# Altium schematic sheet AP62500_4V.SchDoc
size A4; SheetNumber: 5; SheetTotal: 27
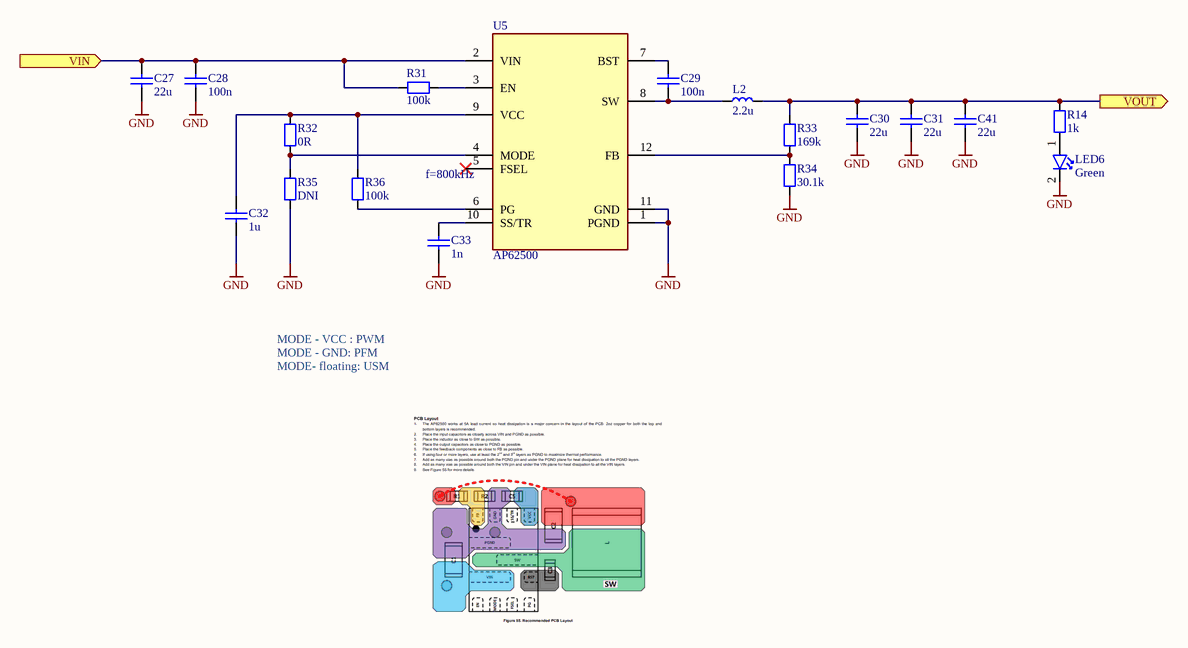
[diagram p0: AP62500_4V.SchDoc]

## Parts
C27  22u  [C_1206_3216Metric_IPC_N]
C28  100n  [C_0603_1608Metric_IPC_N]
C29  100n  [C_0402_1005Metric_IPC_N]
C30  22u  [C_1206_3216Metric_IPC_N]
C31  22u  [C_1206_3216Metric_IPC_N]
C32  1u  [C_0603_1608Metric_IPC_N]
C33  1n  [C_0402_1005Metric_IPC_N]
C41  22u  [C_1206_3216Metric_IPC_N]
L2  2.2u  [AVX_LMLP07A7]
LED6  Green  [LED_0603_1806Metric_IPC_N]
R14  1k  [R_0402_1005Metric_IPC_N]
R31  100k  [R_0402_1005Metric_IPC_N]
R32  0R  [R_0402_1005Metric_IPC_N]
R33  169k  [R_0402_1005Metric_IPC_N]
R34  30.1k  [R_0402_1005Metric_IPC_N]
R35  DNI  [R_0402_1005Metric_IPC_N]
R36  100k  [R_0402_1005Metric_IPC_N]
U5  AP62500  [V-QFN2030-12-Type-A_3.05x2.05mm_P0.5mm]

## Ports
VIN (in, see Power_Supply[3B], AP62500_6V[1B], TPS61377_16V[1B]), VOUT (out, see Power_Supply[3B])

## Nets
GND: C27.1 C28.1 C30.1 C31.1 C32.1 C33.1 C41.1 LED6.2 R34.1 R35.1 U5.1(PGND) U5.11(GND)
VIN: C27.2 C28.2 R31.1 U5.2(VIN) ; port VIN
VOUT: C30.2 C31.2 C41.2 L2.2 R14.1 R33.2 ; port VOUT
NetC29_1: C29.1 L2.1 U5.8(SW)
NetC29_2: C29.2 U5.7(BST)
NetC32_2: C32.2 R32.2 R36.2 U5.9(VCC)
NetC33_2: C33.2 U5.10(SS/TR)
NetLED6_1: LED6.1 R14.2
NetR31_2: R31.2 U5.3(EN)
NetR32_1: R32.1 R35.2 U5.4(MODE)
NetR33_1: R33.1 R34.2 U5.12(FB)
NetR36_1: R36.1 U5.6(PG)

Not connected (* = marked no-connect by the designer): U5 5(FSEL)*

## Notes on the sheet
- (near U5) f=800kHz
- MODE - VCC : PWM
  MODE - GND: PFM
  MODE- floating: USM

## Library data of the parts
C27 C30 C31 C41 = C000005: Generic MLCC with 1206 Footprint; Specific Component: False; ID: C000005; Capacitance: 22u; Tolerance: *; Temp Coefficient: *; Voltage Rated: *; min Temperature: *; max Temperature: *; Case: 1206
C28 C32 = C000003: Generic MLCC with 0603 Footprint; Specific Component: False; ID: C000003; Tolerance: *; Temp Coefficient: *; Voltage Rated: *; min Temperature: *; max Temperature: *; Case: 0603
  C28: Capacitance: 100n
  C32: Capacitance: 1u; Supplier 1: Mouser; Supplier Part Number 1: 81-GRM185R61E105KA2D
C29 C33 = C000002: Generic MLCC with 0402 Footprint; Specific Component: False; ID: C000002; Tolerance: *; Temp Coefficient: *; Voltage Rated: *; min Temperature: *; max Temperature: *; Case: 0402
  C29: Capacitance: 100n; Supplier 1: Digikey; Supplier Part Number 1: 1292-1176-1-ND
  C33: Capacitance: 1n; Supplier 1: Mouser; Supplier Part Number 1: 81-GRM1555C2A102GE1D
L2 = L000012: Power Inductor, 2.2u, 8A, -, 20m, 20%, LMLP07A7; Manufacturer: Kyocera/AVX; Manufacturer Part Number: LMLP07A7M2R2DTAS; Current - Saturation: 12A; min Temperature: -55; max Temperature: +155; ID: L000012; Type: Power Inductor; Inductance: 2.2u; Tolerance: 20%; Current Rating: 8A; DC resistance: 20m; Q @ Freq: -; Case: LMLP07A7; ComponentLink1Description: Datasheet; ComponentLink1URL: https://datasheets.kyocera-avx.com/LMLPD.pdf; Supplier 1: Digikey; Supplier Part Number 1: 478-LMLP07A7M2R2DTASCT-ND; Supplier 2: Mouser; Supplier Part Number 2: 581-LMLP07A7M2R2DTAS
LED6 = LED000007: MLCC, Low Current, Green, 2.2V, 20mA, 0603; Manufacturer: Broadcom / Avago; Manufacturer Part Number: HSMG-C190; Specific Component: True; ID: LED000007; Type: Low Current; Colour: Green; Forward Voltage: 2.2V; Current: 20mA; Case: 0603; ComponentLink1Description: Datasheet; ComponentLink1URL: https://www.mouser.de/datasheet/3/57/1/AV02_0551EN_DS_HSMx_Cxxx_25Mar2022.pdf; Supplier 1: Mouser; Supplier Part Number 1: 630-HSMG-C190; Supplier 2: Digikey; Supplier Part Number 2: 516-1425-1-ND
R14 R31-R36 = R000002: Generic Chip Resistor with 0402 Footprint; Specific Component: False; ID: R000002; Tolerance: *; Power Rating: *; Composition: *; min Temperature: *; max Temperature: *; Temp Coefficient: *; Case: 0402
  R14: Resistance: 1k
  R31 R36: Resistance: 100k
  R32: Resistance: 0R
  R33: Resistance: 169k
  R34: Resistance: 30.1k
  R35: Resistance: DNI
U5 = PMIC000004: Manufacturer: Diodes Incorporated; ID: PMIC000004; Type: DC/DC; Manufacturer Part Number: AP62500; Part Value: AP62500; Case: V-QFN2030-12 (Type A); ComponentLink1Description: Datasheet; ComponentLink1URL: https://www.diodes.com/assets/Datasheets/AP62500.pdf; Supplier 1: Digikey; Supplier Part Number 1: 31-AP62500SJ-7CT-ND; Supplier 2: Mouser; Supplier Part Number 2: 621-AP62500SJ-7